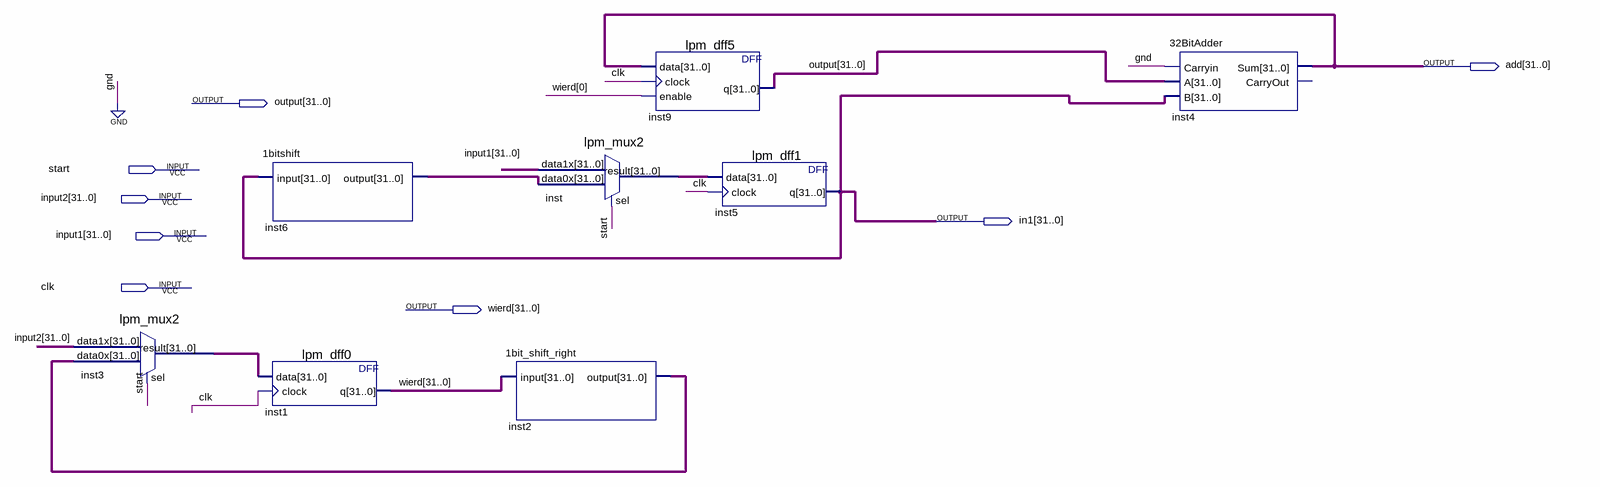
[diagram p0: schematic sheet]
// Quartus schematic mul.bdf as structural Verilog: 8 symbols, 8 pins
module mul (
  input  start,
  input  [31:0] input2,
  input  [31:0] input1,
  input  clk,
  output [31:0] add,
  output [31:0] \output ,
  output [31:0] in1,
  output [31:0] wierd
);

  wire [31:0] inst2_output, inst3_result, inst6_output, inst_result;

  lpm_mux2 inst3 (.data1x(input2), .data0x(inst2_output), .sel(start), .result(inst3_result));
  \1bitshift  inst6 (.\input (in1), .\output (inst6_output));
  lpm_dff0 inst1 (.data(inst3_result), .clock(clk), .q(wierd));
  \1bit_shift_right  inst2 (.\input (wierd), .\output (inst2_output));
  lpm_mux2 inst (.data1x(input1), .data0x(inst6_output), .sel(start), .result(inst_result));
  lpm_dff5 inst9 (.data(add), .clock(clk), .enable(wierd[0]), .q(\output ));
  lpm_dff1 inst5 (.data(inst_result), .clock(clk), .q(in1));
  \32BitAdder  inst4 (.Carryin(1'b0), .A(\output ), .B(in1), .Sum(add));  // open: CarryOut
endmodule
